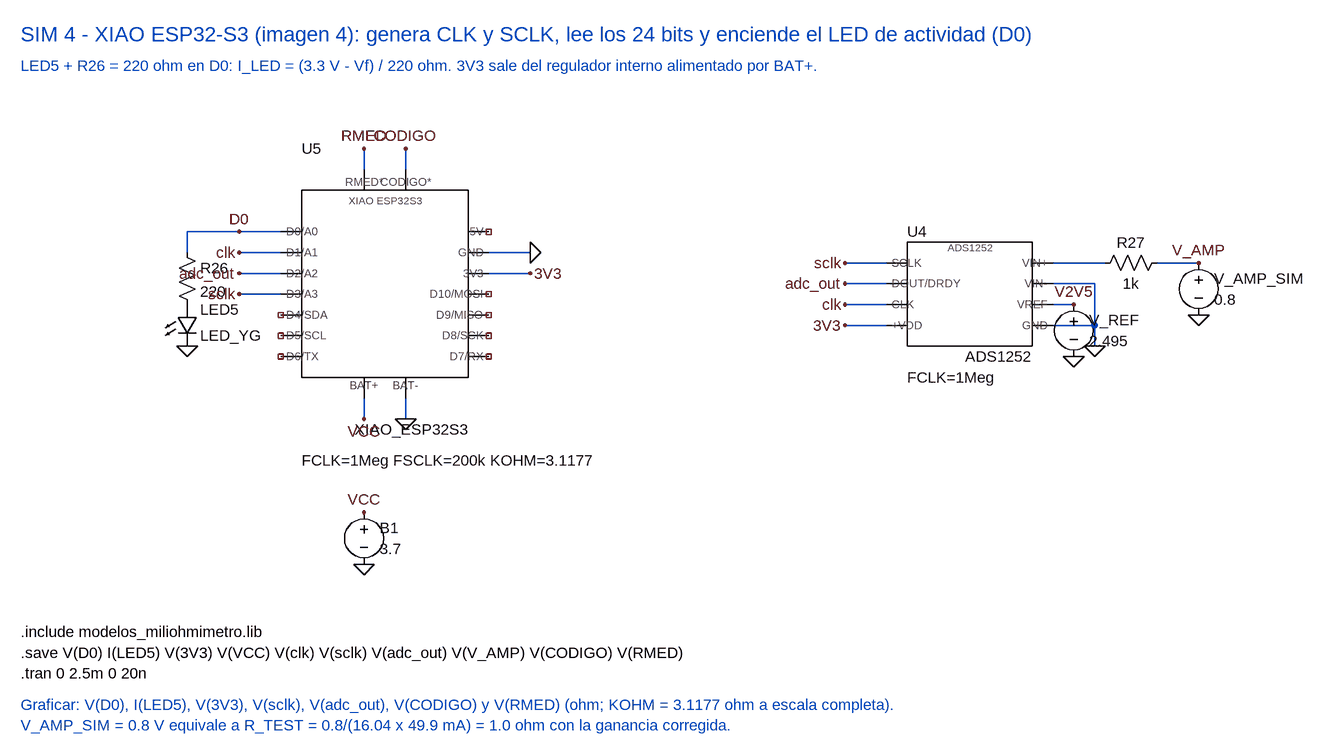
[diagram p0: schematic Sim4_XIAO_ESP32S3.asc]
Sim4_XIAO_ESP32S3.asc, the LTspice schematic file:
Version 4
SHEET 1 2400 1800
WIRE -160 -96 -224 -96
WIRE -160 -64 -224 -64
WIRE -160 -32 -224 -32
WIRE -160 0 -224 0
WIRE 160 -64 224 -64
WIRE 160 -32 224 -32
WIRE -32 160 -32 192
WIRE 32 160 32 192
WIRE -32 -192 -32 -224
WIRE 32 -192 32 -224
WIRE -224 -96 -304 -96
WIRE -304 -96 -304 -64
WIRE 1028 -48 1108 -48
WIRE 1188 -48 1252 -48
WIRE 1028 -16 1092 -16
WIRE 1092 -16 1092 48
WIRE 1028 48 1092 48
WIRE 1092 48 1092 80
WIRE 1028 16 1060 16
WIRE 772 -48 708 -48
WIRE 772 -16 708 -16
WIRE 772 16 708 16
WIRE 772 48 708 48
FLAG -224 -96 D0
FLAG -224 -64 clk
FLAG -224 -32 adc_out
FLAG -224 0 sclk
FLAG 224 -64 0
FLAG 224 -32 3V3
FLAG -32 192 VCC
FLAG 32 192 0
FLAG -32 -224 RMED
FLAG 32 -224 CODIGO
FLAG -304 80 0
FLAG 1252 -48 V_AMP
FLAG 1092 80 0
FLAG 1060 16 V2V5
FLAG 708 -48 sclk
FLAG 708 -16 adc_out
FLAG 708 16 clk
FLAG 708 48 3V3
FLAG 1252 32 0
FLAG 1060 96 0
FLAG -32 336 VCC
FLAG -32 416 0
SYMBOL XIAO_ESP32S3 0 0 R0
WINDOW 0 -128 -224 Left 2
WINDOW 3 128 208 Right 2
WINDOW 39 -128 256 Left 2
SYMATTR InstName U5
SYMATTR Value XIAO_ESP32S3
SYMATTR SpiceLine FCLK=1Meg FSCLK=200k KOHM=3.1177
SYMBOL res -320 -80 R0
WINDOW 0 36 40 Left 2
WINDOW 3 36 76 Left 2
SYMATTR InstName R26
SYMATTR Value 220
SYMBOL LED -320 16 R0
WINDOW 0 36 8 Left 2
WINDOW 3 36 48 Left 2
SYMATTR InstName LED5
SYMATTR Value LED_YG
SYMBOL ADS1252 900 0 R0
WINDOW 0 -96 -96 Left 2
WINDOW 3 96 96 Right 2
WINDOW 39 -96 128 Left 2
SYMATTR InstName U4
SYMATTR Value ADS1252
SYMATTR SpiceLine FCLK=1Meg
SYMBOL res 1204 -64 R90
WINDOW 0 0 56 VBottom 2
WINDOW 3 32 56 VTop 2
SYMATTR InstName R27
SYMATTR Value 1k
SYMBOL voltage 1252 -64 R0
WINDOW 0 24 40 Left 2
WINDOW 3 24 72 Left 2
SYMATTR InstName V_AMP_SIM
SYMATTR Value 0.8
SYMBOL voltage 1060 0 R0
WINDOW 0 24 40 Left 2
WINDOW 3 24 72 Left 2
SYMATTR InstName V_REF
SYMATTR Value 2.495
SYMBOL voltage -32 320 R0
WINDOW 0 24 40 Left 2
WINDOW 3 24 72 Left 2
SYMATTR InstName B1
SYMATTR Value 3.7
TEXT -560 -400 Left 3 ;SIM 4 - XIAO ESP32-S3 (imagen 4): genera CLK y SCLK, lee los 24 bits y enciende el LED de actividad (D0)
TEXT -560 -352 Left 2 ;LED5 + R26 = 220 ohm en D0: I_LED = (3.3 V - Vf) / 220 ohm. 3V3 sale del regulador interno alimentado por BAT+.
TEXT -560 520 Left 2 !.include modelos_miliohmimetro.lib
TEXT -560 552 Left 2 !.save V(D0) I(LED5) V(3V3) V(VCC) V(clk) V(sclk) V(adc_out) V(V_AMP) V(CODIGO) V(RMED)
TEXT -560 584 Left 2 !.tran 0 2.5m 0 20n
TEXT -560 632 Left 2 ;Graficar: V(D0), I(LED5), V(3V3), V(sclk), V(adc_out), V(CODIGO) y V(RMED) (ohm; KOHM = 3.1177 ohm a escala completa).
TEXT -560 664 Left 2 ;V_AMP_SIM = 0.8 V equivale a R_TEST = 0.8/(16.04 x 49.9 mA) = 1.0 ohm con la ganancia corregida.

The netlist it stands for:
* Sim4_XIAO_ESP32S3.asc
XU5 D0 clk adc_out sclk NC_01 NC_02 NC_03 NC_04 NC_05 NC_06 NC_07 3V3 0 NC_08 VCC 0 RMED CODIGO XIAO_ESP32S3 FCLK=1Meg FSCLK=200k KOHM=3.1177  ; pins D0/A0 D1/A1 D2/A2 D3/A3 D4/SDA D5/SCL D6/TX D7/RX D8/SCK D9/MISO D10/MOSI 3V3 GND 5V BAT+ BAT- RMED* CODIGO*
R26 D0 P001 220
D§LED5 P001 0 LED_YG
XU4 N001 0 3V3 clk adc_out sclk 0 V2V5 ADS1252 FCLK=1Meg  ; pins VIN+ VIN- +VDD CLK DOUT/DRDY SCLK GND VREF
R27 V_AMP N001 1k
V_AMP_SIM V_AMP 0 0.8
V_REF V2V5 0 2.495
V§B1 VCC 0 3.7
.model D D
.lib standard.dio
* SIM 4 - XIAO ESP32-S3 (imagen 4): genera CLK y SCLK, lee los 24 bits y enciende el LED de actividad (D0)
* LED5 + R26 = 220 ohm en D0: I_LED = (3.3 V - Vf) / 220 ohm. 3V3 sale del regulador interno alimentado por BAT+.
.include modelos_miliohmimetro.lib
.save V(D0) I(LED5) V(3V3) V(VCC) V(clk) V(sclk) V(adc_out) V(V_AMP) V(CODIGO) V(RMED)
.tran 0 2.5m 0 20n
* Graficar: V(D0), I(LED5), V(3V3), V(sclk), V(adc_out), V(CODIGO) y V(RMED) (ohm; KOHM = 3.1177 ohm a escala completa).
* V_AMP_SIM = 0.8 V equivale a R_TEST = 0.8/(16.04 x 49.9 mA) = 1.0 ohm con la ganancia corregida.
.backanno
.end